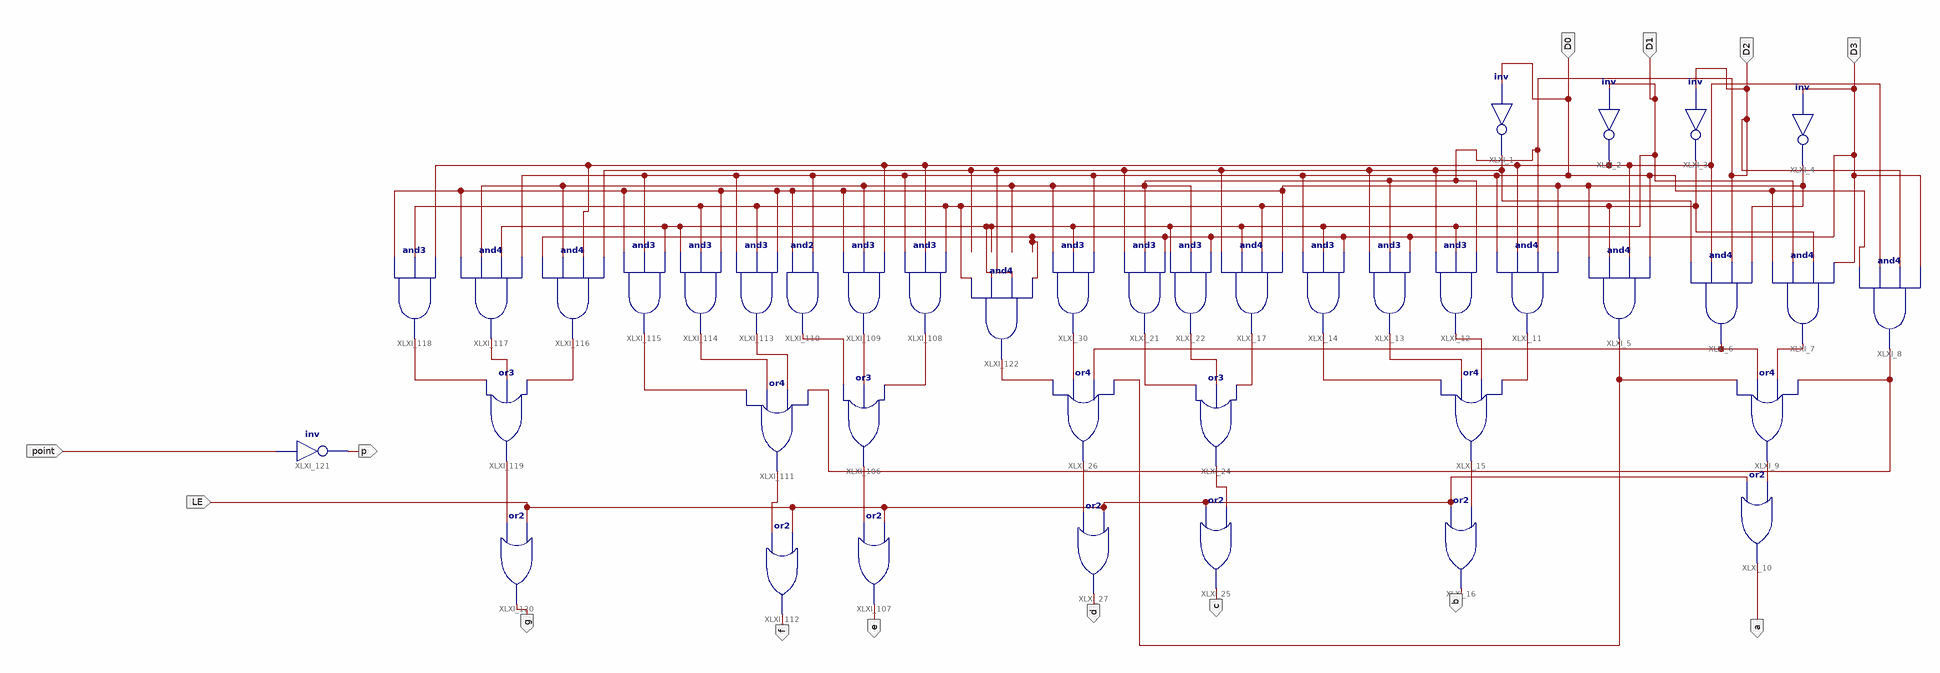
[diagram p0: schematic sheet 1]
// Xilinx ISE schematic MC14495_ZJU.sch (kintex7) as structural Verilog: 41 symbols, 14 ports
module MC14495_ZJU (
  input  D0,
  input  D1,
  input  D3,
  input  D2,
  input  LE,
  input  point,
  output a,
  output b,
  output c,
  output d,
  output e,
  output f,
  output g,
  output p
);

  wire XLXN_24, XLXN_27, XLXN_28, XLXN_29, XLXN_30, XLXN_31, XLXN_38, XLXN_41, XLXN_42, XLXN_43, XLXN_44,
       XLXN_54, XLXN_55, XLXN_56, XLXN_57, XLXN_59, XLXN_62, XLXN_181, XLXN_183, XLXN_184, XLXN_185,
       XLXN_188, XLXN_189, XLXN_190, XLXN_191, XLXN_192, XLXN_196, XLXN_197, XLXN_198, XLXN_199, XLXN_200,
       XLXN_207, XLXN_208;

  not XLXI_1 (XLXN_24, D0);
  not XLXI_2 (XLXN_200, D1);
  not XLXI_3 (XLXN_208, D2);
  not XLXI_4 (XLXN_188, D3);
  and XLXI_5 (XLXN_27, XLXN_188, XLXN_208, XLXN_200, D0);
  and XLXI_6 (XLXN_28, XLXN_24, XLXN_200, D2, XLXN_188);
  and XLXI_8 (XLXN_30, D0, XLXN_200, D2, D3);
  and XLXI_7 (XLXN_29, D0, D1, XLXN_208, D3);
  and XLXI_11 (XLXN_44, D0, XLXN_200, D2, XLXN_188);
  and XLXI_12 (XLXN_43, XLXN_24, D1, D2);
  and XLXI_13 (XLXN_42, XLXN_24, D2, D3);
  and XLXI_14 (XLXN_41, D0, D1, D3);
  and XLXI_17 (XLXN_56, XLXN_24, D1, XLXN_208, XLXN_188);
  and XLXI_22 (XLXN_55, D1, D2, D3);
  and XLXI_21 (XLXN_54, XLXN_24, D2, D3);
  or XLXI_15 (XLXN_38, XLXN_41, XLXN_42, XLXN_43, XLXN_44);
  or XLXI_16 (b, LE, XLXN_38);
  or XLXI_9 (XLXN_31, XLXN_27, XLXN_28, XLXN_29, XLXN_30);
  or XLXI_10 (a, LE, XLXN_31);
  or XLXI_24 (XLXN_57, XLXN_54, XLXN_55, XLXN_56);
  or XLXI_25 (c, LE, XLXN_57);
  or XLXI_26 (XLXN_59, XLXN_207, XLXN_62, XLXN_28, XLXN_27);
  or XLXI_27 (d, XLXN_59, LE);
  and XLXI_30 (XLXN_62, D2, D1, D0);
  or XLXI_106 (XLXN_181, XLXN_185, XLXN_184, XLXN_183);
  or XLXI_107 (e, XLXN_181, LE);
  and XLXI_108 (XLXN_183, D0, XLXN_200, XLXN_208);
  and XLXI_109 (XLXN_184, XLXN_188, D2, XLXN_200);
  and XLXI_110 (XLXN_185, XLXN_188, D0);
  or XLXI_111 (XLXN_189, XLXN_190, XLXN_191, XLXN_192, XLXN_30);
  or XLXI_112 (f, XLXN_189, LE);
  and XLXI_113 (XLXN_192, D0, XLXN_208, XLXN_188);
  and XLXI_114 (XLXN_191, D1, XLXN_208, XLXN_188);
  and XLXI_115 (XLXN_190, XLXN_188, D0, D1);
  and XLXI_116 (XLXN_199, D3, D2, XLXN_200, XLXN_24);
  and XLXI_117 (XLXN_198, XLXN_188, D2, D1, D0);
  and XLXI_118 (XLXN_197, XLXN_188, XLXN_208, XLXN_200);
  or XLXI_119 (XLXN_196, XLXN_197, XLXN_198, XLXN_199);
  or XLXI_120 (g, XLXN_196, LE);
  not XLXI_121 (p, point);
  and XLXI_122 (XLXN_207, XLXN_208, D1, XLXN_24, D3);
endmodule
